# EAGLE design mcp2221_tssop (EAGLE 7.2.0)
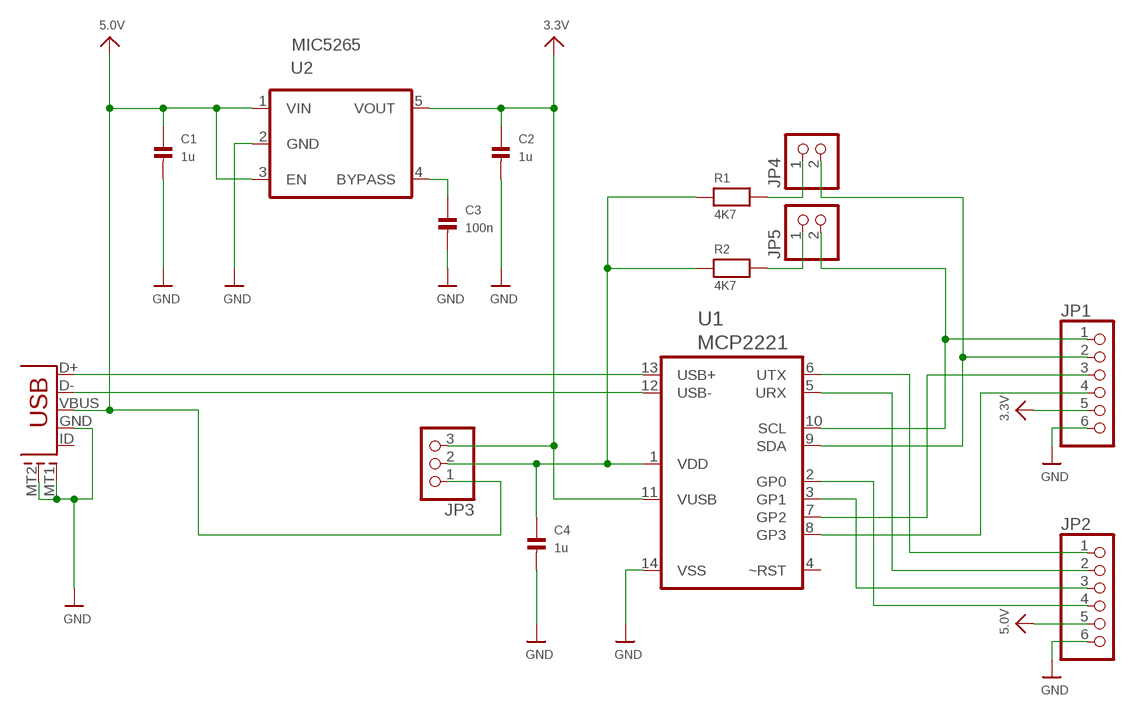
[diagram p0: schematic, sheet 1]

## Parts
C1  1u  CAP_CERAMIC0805  [0805]
C2  1u  CAP_CERAMIC0805  [0805]
C3  100n  CAP_CERAMIC0805  [0805]
C4  1u  CAP_CERAMIC0805  [0805]
JP1  PINHD-1X6  [1X06]
JP2  PINHD-1X6  [1X06]
JP3  PINHD-1X3  [1X03]
JP4  PINHD-1X2  [1X02]
JP5  PINHD-1X2  [1X02]
R1  4K7  RESISTOR0805  [0805]
R2  4K7  RESISTOR0805  [0805]
U1  MCP2221  MCP2221TSSOP  [TSSOP14]
U2  MIC5265  REGULATOR_5  [SOT95P275X110-5N]
USB1  USB-MICROBLARGEPAD  [USB-MICROB_LARGEPAD]

## Nets
3.3V: C2.1 JP1.5 JP3.3 U1.11(VUSB) U2.5(VOUT)
5.0V: C1.1 JP2.5 JP3.1 U2.1(VIN) U2.3(EN) USB1.VBUS
GND: C1.2 C2.2 C3.2 C4.2 JP1.6 JP2.6 U1.14(VSS) U2.2(GND) USB1.GND USB1.MT1(SHEILD1) USB1.MT2(SHEILD2)
N$1: JP1.4 U1.8(GP3)
N$3: C3.1 U2.4(BYPASS)
N$4: U1.13(USB+) USB1.D+
N$6: JP1.3 U1.7(GP2)
N$7: C4.1 JP3.2 R1.1 R2.1 U1.1(VDD)
N$8: JP2.1 U1.6(UTX)
N$9: U1.12(USB-) USB1.D-
N$10: JP5.1 R2.2
N$11: JP2.2 U1.5(URX)
N$12: JP2.3 U1.3(GP1)
N$13: JP2.4 U1.2(GP0)
N$14: JP4.1 R1.2
N$15: JP1.2 JP4.2 U1.9(SDA)
N$16: JP1.1 JP5.2 U1.10(SCL)
Unconnected: U1.4(~RST) USB1.ID

## Library data of the parts
C1-C4 = microbuilder:CAP_CERAMIC: Ceramic Capacitors 0402 - 0402 Surface Mount Capacitors 16pF 50V 5% [Digikey: 445-4899-2-ND] 18pF 50V 5% [Digikey: 490-1281-2-ND] 22pF 50V 5% [Digikey: 490-1283-2-ND] 68pF 50V 5% [Digikey: 490-1289-2-ND] 0.1uF 10V 10% [Digikey: 490-1318-2-ND] 1.0uF 6.3V 10% [Digikey: 490-1320-2-ND] 0603 - 0603 Surface Mount Capacitors 16 pF 50V 5% [Digikey: 445-5051-2-ND] 22 pF 50V [Digikey: PCC220ACVTR-ND] 33 pF 50V 5% [Digikey: 490-1415-1-ND] 56pF 50V 5% [Digikey: 490-1421-1-ND] 220pF 50V 5% [Digikey: 445-1285-1-ND] 680 pF 50V 2200 pF 50V 5% C0G [Digikey: 445-1297-1-ND] 5600 pF 100V 5% X7R [Digikey: 478-3711-1-ND] 0.1 µF 25V 10% [Digikey: PCC2277TR-ND] 0.22 µF 16V 10% X7R [Digikey: 445-1318-1-ND] 1.0 µF 25V 10% [Digikey: 445-5146-2-ND] 0603 - RF Specific 3pF 250V +/-0.1pF RF [Digikey: 712-1347-1-ND] 18 pF 250V 5% [Digikey: 478-3505-1-ND or 712-1322-1-ND] 56 pF 250V 5% C0G RF [Digikey: 490-4867-1-ND] 68 pF 250V RF [Digikey: 490-4868-1-ND] 0805 - 0805 Surface Mount Capacitors 220 pF 250V 2% RF Ceramic Capacitor [Digikey: 712-1398-1-ND] 1000 pF 50V 2% NP0 Ceramic Capacitor [Digikey: 478-3760-1-ND] 0.1 µF 25V 10% Ceramic Capacitor [Digikey: PCC1828TR-ND] 1.0 µF 16V 10% Ceramic Capacitor[Digikey: 490-1691-2-ND] 10.0 µF 10V 10% Ceramic Capacitor[Digikey: 709-1228-1-ND] 10.0 uF 16V 10% Ceramic Capacitor [Digikey: 478-5165-2-ND] 47 uF 6.3V 20% Ceramic Capacitor [Digikey: 587-1779-1-ND or 399-5506-1-ND] 1206 - 1206 Surface Mount Capacitors 47uF 10V 20% Ceramic Capacitor [Digikey: 490-5528-1-ND or 399-5508-1-ND or 445-6010-1-ND] 100uF 6.3V -20%, +80% Y5V Ceramic Capacitor (Digikey: 490-4512-1-ND, Mouser: 81-GRM31CF50J107ZE1L)
JP1 JP2 = pinhead:PINHD-1X6: PIN HEADER
JP3 = pinhead:PINHD-1X3: PIN HEADER
JP4 JP5 = pinhead:PINHD-1X2: PIN HEADER
R1 R2 = microbuilder:RESISTOR: Resistors 0402 - 0402 Surface Mount Package 22 Ohm 1% 1/16W [Digikey: 311-22.0LRTR-ND] 33 Ohm 5% 1/16W 1.0K 5% 1/16W 1.5K 5% 1/16W 2.0K 1% 1/16W 10.0K 1% 1/16W [Digikey: 311-10.0KLRTR-ND] 10.0K 5% 1/16W [Digikey: RMCF0402JT10K0TR-ND] 12.1K 1% 1/16W [Digikey: 311-22.0LRTR-ND] 100.0K 5% 1/16W 0603 - 0603 Surface Mount Package 0 Ohm 1/10 Watt 1% Resistor 15 Ohm 1/10 Watt 1% Resistor 33 Ohm 1/10 Watt 1% Resistor 49.9 Ohm 1/10 Watt 1% Resistor 100 Ohm 1/10 Watt 1% Resistor 150 Ohm 1/10 Watt 1% Resistor 240 Ohm 1/10 Watt 1% Resistor 390 Ohm 1/10 Watt 1% Resistor 560 Ohm 1/10 Watt 1% Resistor 680 Ohm 1/10 Watt 1% Resistor 750 Ohm 1/10 Watt 1% Resistor 1.0K Ohm 1/10 Watt 1% Resistor 1.5K Ohm 1/10 Watt 1% Resistor 2.0K Ohm 1/10 Watt 1% Resistor 2.2K Ohm 1/10 Watt 1% Resistor 3.3K Ohm 1/10 Watt 1% Resistor 4.7K Ohm 1/10 Watt 1% Resistor 10.0K Ohm 1/10 Watt 1% Resistor 12.0K Ohm 1/10 Watt 1% Resistor 12.1K Ohm 1/10 Watt 1% Resistor 20.0K Ohm 1/10 Watt 1% Resistor 33.0K Ohm 1/10 Watt 1% Resistor 100.0K Ohm 1/10 Watt 1% Resistor 0805 - 0805 Surface Mount Package 0 Ohm 1/8 Watt 1% Resistor 33 Ohm 1/8 Watt 1% Resistor 100 Ohm 1/8 Watt 1% Resistor 150 Ohm 1/8 Watt 1% Resistor 200 Ohm 1/8 Watt 1% Resistor 240 Ohm 1/8 Watt 1% Resistor 330 Ohm 1/8 Watt 1% Resistor 390 Ohm 1/8 Watt 1% Resistor 470 Ohm 1/8 Watt 1% Resistor 1.0K Ohm 1/8 Watt 1% Resistor 1.5K Ohm 1/8 Watt 1% Resistor 2.0K Ohm 1/8 Watt 1% Resistor 4.7K Ohm 1/8 Watt 1% Resistor 5.1K Ohm 1/8 Watt 1% Resistor 5.6K Ohm 1/8 Watt 1% Resistor 10.0K Ohm 1/8 Watt 1% Resistor 22.0K Ohm 1/8 Watt 1% Resistor 33.0K Ohm 1/8 Watt 1% Resistor 100K Ohm 1/8 Watt 1% Resistor 1206 - 1206 Surface Mount Package 2012 - 2010 Surface Mount Package 0.11 Ohm 1/2 Watt 1% Resistor - Digikey: RHM.11UCT-ND
U1 = zak:MCP2221
U2 = zak:REGULATOR_5
USB1 = zak:USB-MICROB

## Board
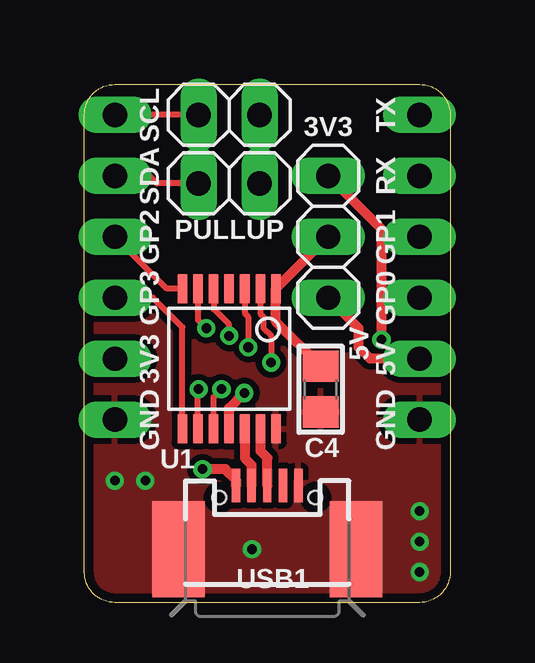
[diagram p1: board, top side]
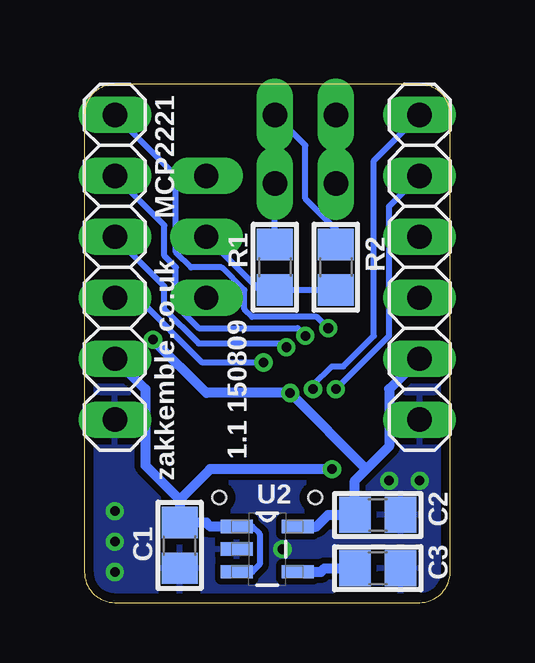
[diagram p2: board, bottom side, seen from below]

Size 15.24 x 21.59 mm. Coordinates in mm from the lower left corner, seen from the top.
Outline: 1.27,0 arc-90 0,1.27 0,20.32 arc-90 1.27,21.59 13.97,21.59 arc-90 15.24,20.32 15.24,1.27 arc-90 13.97,0 1.27,0
Copper layers (1*16): Top 0.0356mm / dielectric 1.5011mm / Bottom 0.0356mm
Design rules "LaenPCBOrder *": minimum track width 6mil, minimum drill 13mil, track to track 6mil, track to pad 6mil, pad to pad 6mil, via to via 6mil, smd to smd 6mil, copper to edge 15mil, drill to drill 6mil, minimum pad ring 7mil, minimum via ring 7mil, stop-mask expansion 4mil, vias tented up to drill 26mil, thermal gap 10mil

### Footprints (pad centres in the part's own frame; a part is rotated, then mirrored left to right if it is on the bottom)
0805 = smd 1.3 x 1.5: 1 -0.95,0; 2 0.95,0
1X06 = drill 1.016 long: 1 -6.35,0; 2 -3.81,0; 3 -1.27,0; 4 1.27,0; 5 3.81,0; 6 6.35,0
1X03 = drill 1.016 long: 1 -2.54,0; 2 0,0; 3 2.54,0
1X02 = drill 1.016 long: 1 -1.27,0; 2 1.27,0
TSSOP14 = smd 1.2 x 0.4: 1 -2.918,1.95; 2 -2.918,1.3; 3 -2.918,0.65; 4 -2.918,0; 5 -2.918,-0.65; 6 -2.918,-1.3; 7 -2.918,-1.95; 8 2.918,-1.95; 9 2.918,-1.3; 10 2.918,-0.65; 11 2.918,0; 12 2.918,0.65; 13 2.918,1.3; 14 2.918,1.95
SOT95P275X110-5N = smd 1.321 x 0.559: 1 -1.27,0.94; 2 -1.27,0; 3 -1.27,-0.94; 4 1.27,-0.94; 5 1.27,0.94
USB-MICROB_LARGEPAD = smd 0.35 x 1.4: D+ 0,2.65; D- -0.65,2.65; GND 1.3,2.65; ID 0.65,2.65; VBUS -1.3,2.65 | smd 2.2 x 4: MT1 -3.7,0; MT2 3.7,0 | hole 0.55: -2,2.15; 2,2.15

### Placement (x,y rotation side)
C1  11.27,2.38 270 bottom
C2  3.02,3.65 0 bottom
C3  3.02,1.43 0 bottom
C4  9.84,8.89 270 top
JP1  1.27,13.97 270 bottom
JP2  13.97,13.97 270 bottom
JP3  10.16,15.24 90 top
JP4  6.03,17.46 180 top
JP5  6.03,20.32 180 top
R1  7.3,13.97 90 bottom
R2  4.76,13.97 90 bottom
U1  6.03,10.16 270 top
U2  7.62,2.22 0 bottom
USB1  7.62,2.22 0 top

### Tracks (layer width: path | path; a pad name or v marks a point on that pad's centre or on a via)
3.3V  (via drill 0.4)
  Top 0.406: U1.11 6.03,8.1 v6.67,8.73 | v12.38,10.95 12.38,15.56 JP3.3
  Bottom 0.406: JP1.5 2.54,8.89 2.54,6.51 3.49,5.56 | U2.5 5.57,3.16 5.08,3.65 C2.1 3.97,5.08 3.49,5.56 | v12.38,10.95 10.16,8.73 v6.67,8.73 3.49,5.56
5.0V  (via drill 0.4)
  Top 0.406: 5.64,5.56 v4.92,5.56 5.87,5.56 6.32,5.11 USB1.VBUS | JP2.5 11.91,10.16 11.43,10.64 11.43,11.43 JP3.1
  Bottom 0.254: U2.3 8.24,1.28 7.94,1.59 7.94,2.86 8.24,3.16 U2.1
  Bottom 0.406: v4.92,5.56 10,5.56 11.27,4.29 | JP2.5 12.7,8.89 12.7,5.71 11.27,4.29 | U2.1 9.99,3.16 10.16,3.33 11.11,3.33 C1.1 11.27,4.29
GND  (via drill 0.4)
  other vias: 13.97,1.27 13.97,2.54 13.97,3.81 1.27,5.08 2.54,5.08 6.99,2.22
  pour Top (isolate 0.254, rank 6): 0,0 0,21.59 15.24,21.59 15.24,0
  pour Bottom (isolate 0.254, rank 6): 0,0 0,21.59 15.24,21.59 15.24,0
  pour Top (isolate 0.254, rank 6, no thermals): 12.7,0 12.7,5.08 2.54,5.08 2.54,0
N$1
  Top 0.254: JP1.4 2.86,12.7 4.08,11.47 U1.8
N$3
  Bottom 0.406: U2.4 5.38,1.28 5.24,1.43 C3.1
N$4
  Top 0.406: USB1.D+ 7.62,6.03 7.33,6.32 U1.13
N$6
  Top 0.254: U1.7 3.43,13.08 JP1.3
N$7
  Top 0.406: C4.1 7.98,11.7 U1.1 10.14,15.24 JP3.2
  Bottom 0.254: R2.1 R1.1 7.94,13.02 JP3.2
N$8  (via drill 0.4)
  Top 0.254: U1.6 4.73,11.78 v5.08,11.43
  Bottom 0.254: v5.08,11.43 5.56,11.91 8.26,11.91 8.57,12.22 8.57,13.02 9.53,13.97 10.79,13.97 11.43,14.61 11.43,17.78 JP2.1
N$9
  Top 0.406: USB1.D- 6.97,5.73 6.68,6.02 U1.12
N$10
  Bottom 0.254: R2.2 4.76,15.56 6.03,16.83 6.03,19.05 JP5.1
N$11  (via drill 0.4)
  Top 0.254: v6.03,11.11 6.03,11.59 5.38,12.24 U1.5
  Bottom 0.254: v6.03,11.11 6.35,11.43 10.48,11.43 11.43,12.38 11.43,13.97 11.91,14.45 11.91,15.72 JP2.2
N$12  (via drill 0.4)
  Top 0.254: U1.3 6.68,12.05 6.83,11.91 v6.83,10.64
  Bottom 0.254: v6.83,10.64 6.99,10.79 10.48,10.79 11.91,12.22 11.91,13.18 JP2.3
N$13  (via drill 0.4)
  Top 0.254: U1.2 7.33,12.04 7.46,11.91 7.46,11.43 7.78,11.11 v7.78,10
  Bottom 0.254: v7.78,10 10.32,10 13.02,12.7 JP2.4
N$14
  Bottom 0.254: R1.2 JP4.1
N$15  (via drill 0.4)
  Top 0.254: U1.9 4.73,8.86 v4.76,8.89 | JP4.2 3.02,17.46 2.7,17.78 JP1.2
  Bottom 0.254: JP1.2 2.54,16.51 2.54,11.11 v4.76,8.89
N$16  (via drill 0.4)
  Top 0.254: U1.10 5.38,8.56 v5.71,8.89 | JP5.2 JP1.1
  Bottom 0.254: JP1.1 3.17,18.41 3.17,11.11 4.45,9.84 4.92,9.84 5.71,9.05 v5.71,8.89

### Text on the board
tPlace: SCL | 3V3 | TX | SDA | RX | PULLUP | GP2 | GP1 | GP3 | GP0 | 5V | 3V3 | 5V | GND | GND
bPlace: MCP2221 | zakkemble.co.uk | 1.1 150809